# EAGLE design Arduino (EAGLE 6.5.0)
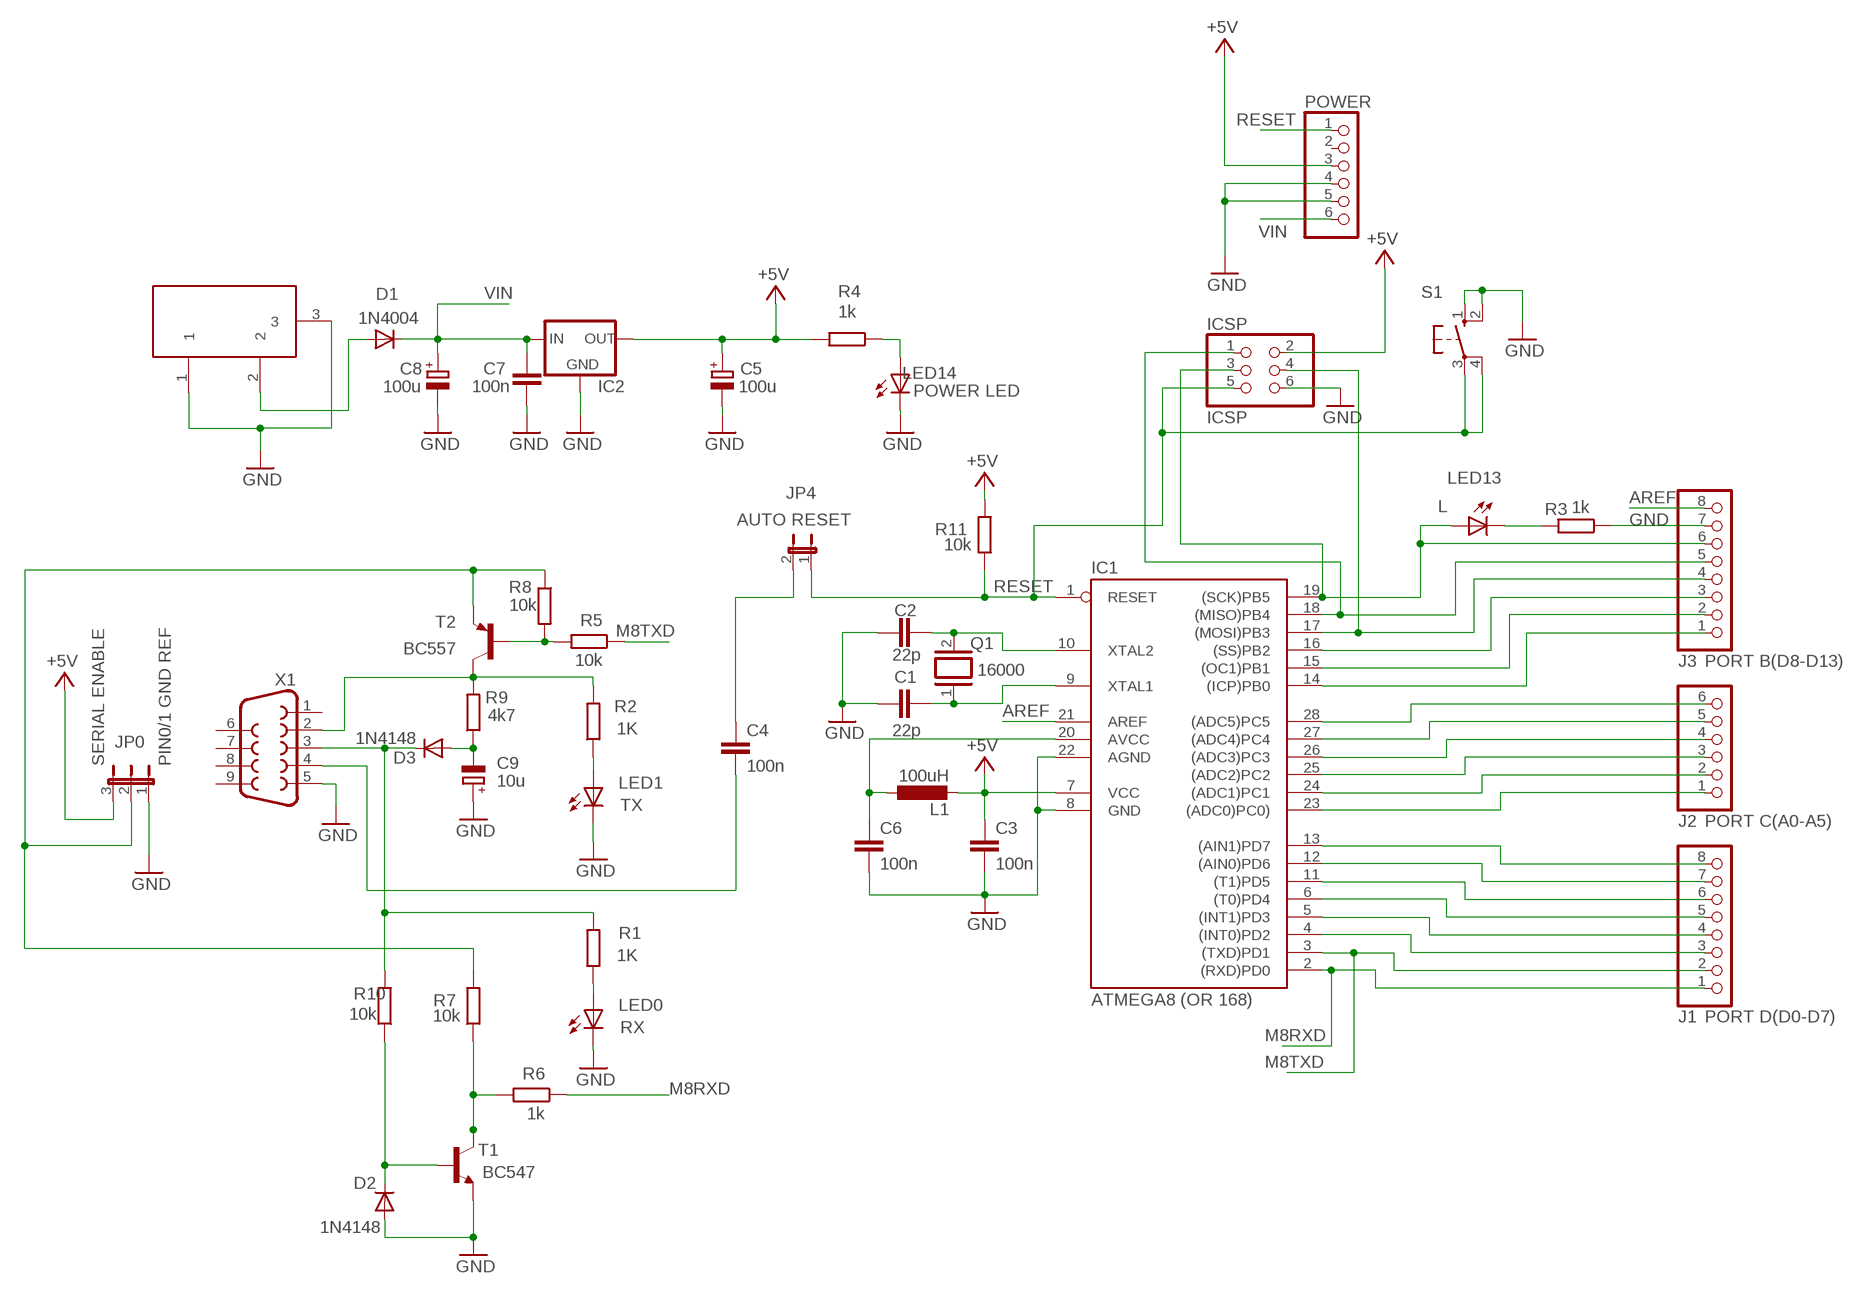
[diagram p0: schematic, sheet 1]

## Parts
C1  22p  C-EU050-025X075  [C050-025X075]
C2  22p  C-EU050-025X075  [C050-025X075]
C3  100n  C-EU050-025X075  [C050-025X075]
C4  100n  C-EU050-025X075  [C050-025X075]
C5  100u  CPOL-EUE3.5-8  [E3,5-8]
C6  100n  C-EU050-025X075  [C050-025X075]
C7  100n  C-EU050-025X075  [C050-025X075]
C8  100u  CPOL-EUE3.5-8  [E3,5-8]
C9  10u  CPOL-EUE5-6  [E5-6]
D1  1N4004  [DO41-10]
D2  1N4148  [DO35-10]
D3  1N4148  [DO35-10]
DC1  DC21MMX  [DC-21MM]
IC1  ATMEGA8 (OR 168)  AT90S4433P  [DIL28-3]
IC2  78XXL  [78XXL]
ICSP  ICSP  PINHD-2X3  [2X03]
J1  PORT D(D0-D7)  PINHD-1X8  [1X08]
J2  PORT C(A0-A5)  PINHD-1X6  [1X06]
J3  PORT B(D8-D13)  PINHD-1X8  [1X08]
JP0  JP2W  [JP2W]
JP4  AUTO RESET  JP1W  [JP1W]
L1  100uH  L-EU0207/10  [0207/10]
LED0  RX  LED3MM  [LED3MM]
LED1  TX  LED3MM  [LED3MM]
LED13  L  LED3MM  [LED3MM]
LED14  POWER LED  LED3MM  [LED3MM]
POWER  PINHD-1X6  [1X06]
Q1  16000  XTAL  [Q]
R1  1K  R-EU_0207/10  [0207/10]
R2  1K  R-EU_0207/10  [0207/10]
R3  1k  R-EU_0207/10  [0207/10]
R4  1k  R-EU_0207/10  [0207/10]
R5  10k  R-EU_0207/10  [0207/10]
R6  1k  R-EU_0207/10  [0207/10]
R7  10k  R-EU_0207/10  [0207/10]
R8  10k  R-EU_0207/10  [0207/10]
R9  4k7  R-EU_0207/10  [0207/10]
R10  10k  R-EU_0207/10  [0207/10]
R11  10k  R-EU_0207/10  [0207/10]
S1  10-XX  [B3F-10XX]
T1  BC547  [TO92]
T2  BC557  BC557B-PNP-TO92-EBC  [TO92-EBC]
X1  F09H  [F09H]

## Nets
+5V [power]: C3.1 C5.+ IC1.7(VCC) IC2.OUT ICSP.2 JP0.3 L1.2 POWER.3 R4.2 R11.2
AREF: IC1.21(AREF) J3.8
GND: C1.1 C2.1 C3.2 C5.- C6.2 C7.1 C8.- C9.+ D2.A DC1.1 DC1.3 IC1.8(GND) IC1.22(AGND) IC2.GND ICSP.6 J3.7 JP0.1 LED0.K(C) LED1.K(C) LED14.K(C) POWER.4 POWER.5 R3.1 S1.1(S) S1.2(S1) T1.1(E) X1.5
M8RXD: IC1.2((RXD)PD0) J1.1 R6.1
M8TXD: IC1.3((TXD)PD1) J1.2 R5.1
N$1: IC1.18((MISO)PB4) ICSP.1 J3.5
N$2: C9.- D3.A R9.1
N$3: LED14.A R4.1
N$4: IC1.17((MOSI)PB3) ICSP.4 J3.4
N$5: IC1.14((ICP)PB0) J3.1
N$6: C1.2 IC1.9(XTAL1) Q1.1
N$7: C2.2 IC1.10(XTAL2) Q1.2
N$8: D1.A DC1.2
N$10: IC1.4((INT0)PD2) J1.3
N$11: IC1.5((INT1)PD3) J1.4
N$12: IC1.6((T0)PD4) J1.5
N$13: IC1.11((T1)PD5) J1.6
N$14: IC1.12((AIN0)PD6) J1.7
N$15: IC1.13((AIN1)PD7) J1.8
N$16: IC1.23((ADC0)PC0)) J2.1
N$17: IC1.24((ADC1)PC1) J2.2
N$18: IC1.25((ADC2)PC2) J2.3
N$19: IC1.26((ADC3)PC3) J2.4
N$20: IC1.27((ADC4)PC4) J2.5
N$21: IC1.28((ADC5)PC5) J2.6
N$22: IC1.15((OC1)PB1) J3.2
N$23: IC1.16((SS)PB2) J3.3
N$25: D3.C R1.2 R10.2 X1.3
N$26: R6.2 R7.1 T1.3(C)
N$27: R5.2 R8.2 T2.B
N$29: D2.C R10.1 T1.2(B)
N$31: LED13.K(C) R3.2
N$32: LED1.A R2.1
N$33: LED0.A R1.1
N$34: C4.1 JP4.2
N$38: C4.2 X1.4
N$39: R2.2 R9.2 T2.C X1.2
N$42 [power]: C6.1 IC1.20(AVCC) L1.1
RESET: IC1.1(RESET) ICSP.5 JP4.1 POWER.1 R11.1 S1.3(P) S1.4(P1)
SCK: IC1.19((SCK)PB5) ICSP.3 J3.6 LED13.A
SERIAL_VCC: JP0.2 R7.2 R8.1 T2.E
VIN [power]: C7.2 C8.+ D1.C IC2.IN POWER.6
Unconnected: POWER.2 X1.1 X1.6 X1.7 X1.8 X1.9

## Notes on the sheet
- SERIAL ENABLE | PIN0/1 GND REF

## Library data of the parts
C1-C4 C6 C7 = rcl:C-EU: CAPACITOR, European symbol
C5 C8 C9 = rcl:CPOL-EU: POLARIZED CAPACITOR, European symbol
D1 = diode:1N4004: DIODE general purpose rectifier, 1 A
D2 D3 = diode:1N4148: DIODE high speed (Philips)
DC1 = powersupply:DC21MM
IC1 = atmel:AT90S4433: MICROCONTROLLER 4 Kbytes FLASH 128 bytes SRAM 256 bytes EEPROM UART 6-channel 10 bit ADC
IC2 = v-reg:78XXL: VOLTAGE REGULATOR
ICSP = pinhead:PINHD-2X3: PIN HEADER
J1 J3 = pinhead:PINHD-1X8: PIN HEADER
J2 POWER = pinhead:PINHD-1X6: PIN HEADER
JP0 = jumper:JP2W: JUMPER
JP4 = jumper:JP1W
L1 = rcl:L-EU: INDUCTOR, European symbol
LED0 LED1 LED13 LED14 = led:LED: LED OSRAM: - CHIPLED LG R971, LG N971, LY N971, LG Q971, LY Q971, LO R971, LY R971 LH N974, LH R974 LS Q976, LO Q976, LY Q976 LO Q996 - Hyper CHIPLED LW Q18S LB Q993, LB Q99A, LB R99A - SideLED LS A670, LO A670, LY A670, LG A670, LP A670 LB A673, LV A673, LT A673, LW A673 LH A674 LY A675 LS A676, LA A676, LO A676, LY A676, LW A676 LS A679, LY A679, LG A679 - Hyper Micro SIDELED® LS Y876, LA Y876, LO Y876, LY Y876 LT Y87S - SmartLED LW L88C, LW L88S LB L89C, LB L89S, LG L890 LS L89K, LO L89K, LY L89K LS L896, LA L896, LO L896, LY L896 - TOPLED LS T670, LO T670, LY T670, LG T670, LP T670 LSG T670, LSP T670, LSY T670, LOP T670, LYG T670 LG T671, LOG T671, LSG T671 LB T673, LV T673, LT T673, LW T673 LH T674 LS T676, LA T676, LO T676, LY T676, LB T676, LH T676, LSB T676, LW T676 LB T67C, LV T67C, LT T67C, LS T67K, LO T67K, LY T67K, LW E67C LS E67B, LA E67B, LO E67B, LY E67B, LB E67C, LV E67C, LT E67C LW T67C LS T679, LY T679, LG T679 LS T770, LO T770, LY T770, LG T770, LP T770 LB T773, LV T773, LT T773, LW T773 LH T774 LS E675, LA E675, LY E675, LS T675 LS T776, LA T776, LO T776, LY T776, LB T776 LHGB T686 LT T68C, LB T68C - Hyper Mini TOPLED® LB M676 - Mini TOPLED Santana® LG M470 LS M47K, LO M47K, LY M47K Source: http://www.osram.convergy.de/
Q1 = special:XTAL: CRYSTAL
R1-R11 = rcl:R-EU_: RESISTOR, European symbol
S1 = switch-omron:10-XX: OMRON SWITCH
T1 = transistor:BC547: NPN TRANSISTOR
T2 = transistor:*-PNP-: PNP Transistror
X1 = con-subd:F09: SUB-D

## Net classes
1 power: width 0.61 mm

## Board
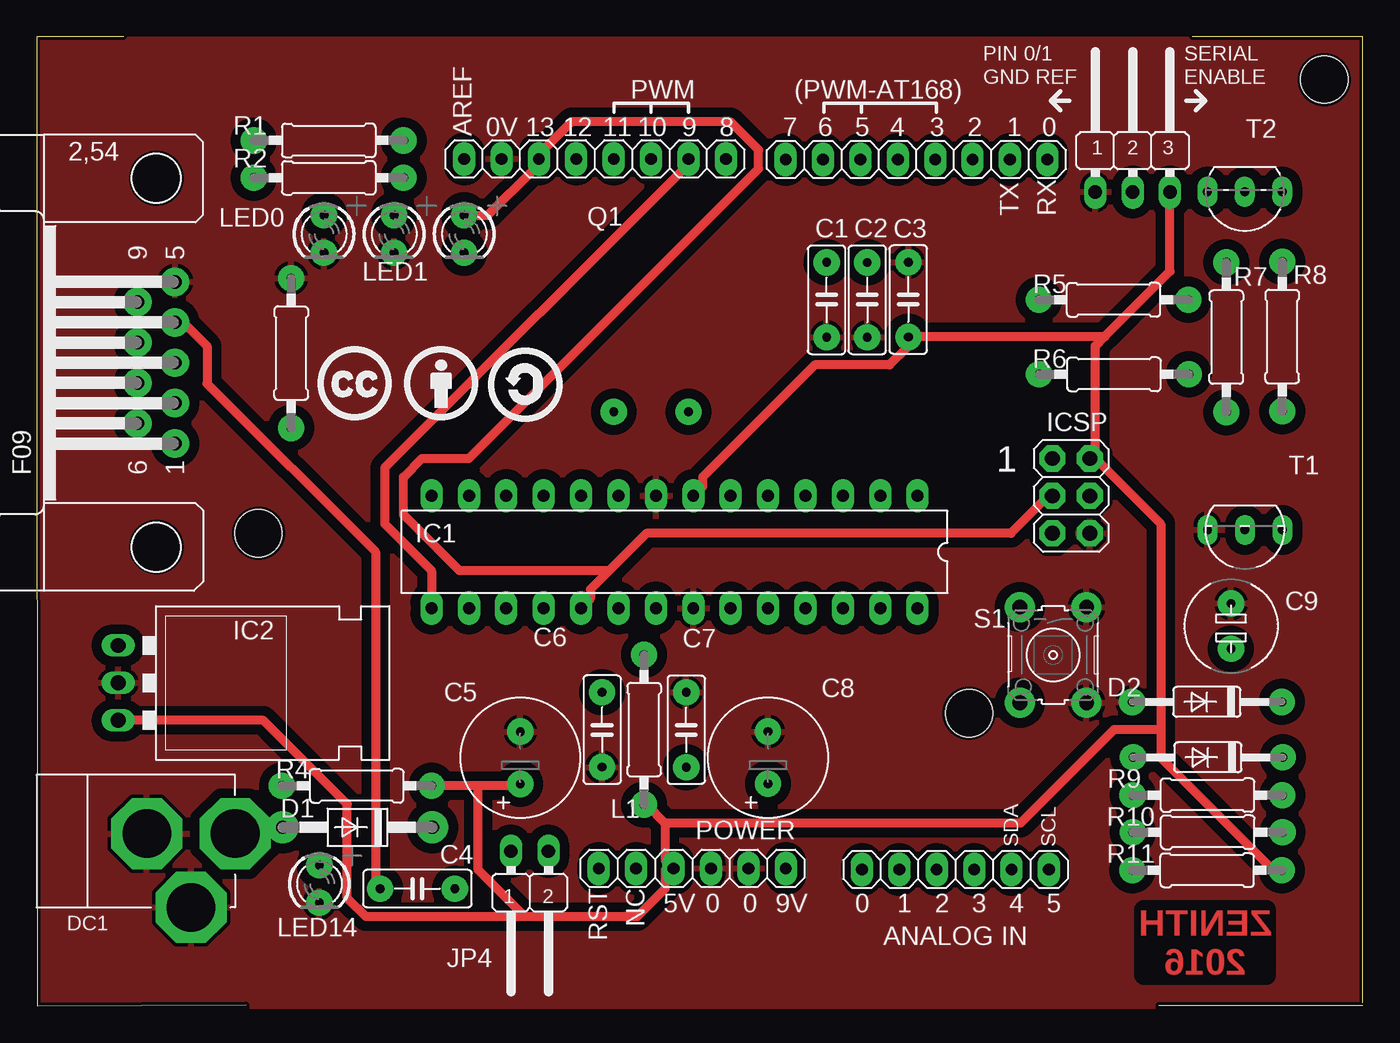
[diagram p1: board, top side]
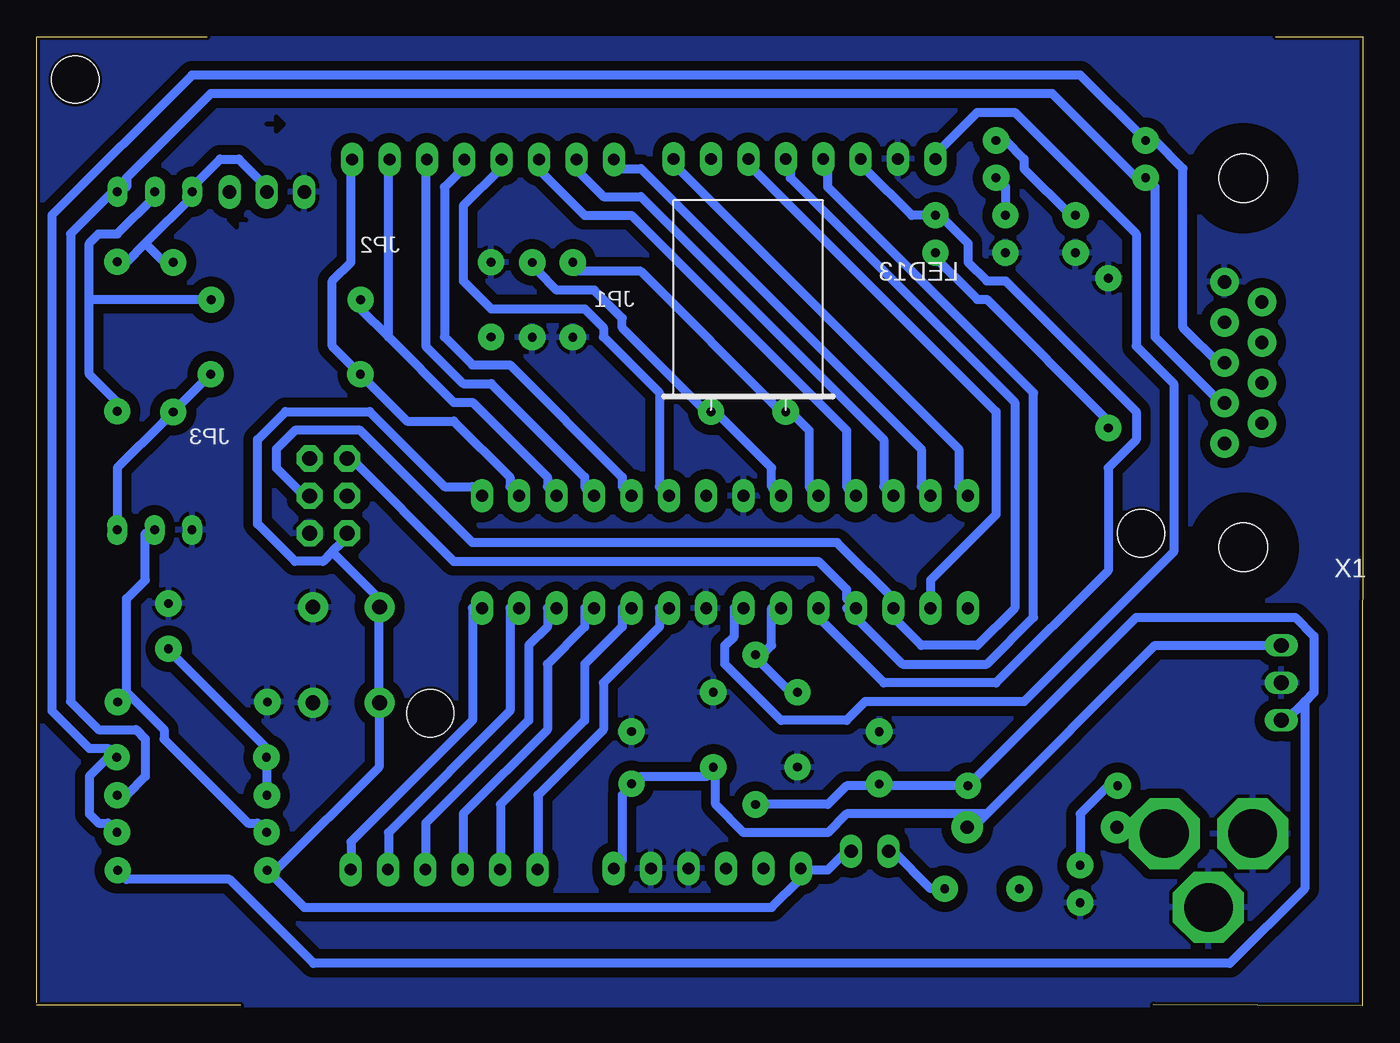
[diagram p2: board, bottom side, seen from below]

Size 90.06 x 65.8 mm. Coordinates in mm from the lower left corner, seen from the top.
Outline: 0.01,65.8 0.01,55.13 0.02,0 14.23,0.06
Outline: 76.2,0.06 90.06,0.06
Outline: 90.05,65.78 78.5,65.78
Outline: 5.91,65.79 0,65.79
Outline: 90.06,0.21 90.06,54.39
Outline: 90.05,54.23 90.05,65.78
Copper layers (1*16): Top 0.035mm / dielectric 1.5mm / Bottom 0.035mm
Design rules "gizmo *": minimum track width 0.6mm, minimum drill 40mil, track to track 0.67mm, track to pad 0.67mm, pad to pad 0.67mm, via to via 0.67mm, smd to smd 0mil, copper to edge 8mil, drill to drill 8mil, minimum pad ring 10mil, minimum via ring 8mil, stop-mask expansion 0mil, vias tented up to drill 0mil, thermal gap 10mil
Holes 3.2 mm at 87.45,62.89 63.32,19.86 15.06,32.09
bRestrict: 6 lines

### Footprints (pad centres in the part's own frame; a part is rotated, then mirrored left to right if it is on the bottom)
C050-025X075 = drill 0.6 pad 1.778: 1 -2.54,0; 2 2.54,0
E3,5-8 = drill 0.6 pad 1.778: + -1.778,0; - 1.778,0
E5-6 = drill 0.6 pad 1.778: + -1.54,0; - 1.54,0
DO41-10 = drill 0.9 pad 2.159: A 5.08,0; C -5.08,0
DO35-10 = drill 0.6 pad 1.778: A 5.08,0; C -5.08,0
DC-21MM = drill 3.302 pad 4.826 octagon: 1 -5.08,-3.353; 2 -0.076,-6.35; 3 -0.076,-0.356
DIL28-3 = drill 0.813 pad 1.524 long: 1 -16.51,-3.81; 2 -13.97,-3.81; 3 -11.43,-3.81; 4 -8.89,-3.81; 5 -6.35,-3.81; 6 -3.81,-3.81; 7 -1.27,-3.81; 8 1.27,-3.81; 9 3.81,-3.81; 10 6.35,-3.81; 11 8.89,-3.81; 12 11.43,-3.81; 13 13.97,-3.81; 14 16.51,-3.81; 15 16.51,3.81; 16 13.97,3.81; 17 11.43,3.81; 18 8.89,3.81; 19 6.35,3.81; 20 3.81,3.81; 21 1.27,3.81; 22 -1.27,3.81; 23 -3.81,3.81; 24 -6.35,3.81; 25 -8.89,3.81; 26 -11.43,3.81; 27 -13.97,3.81; 28 -16.51,3.81
78XXL = drill 1.016 long: GND 0,-3.81; IN -2.54,-3.81; OUT 2.54,-3.81
2X03 = drill 1 pad 1.778 octagon: 1 -2.54,-1.27; 2 -2.54,1.27; 3 0,-1.27; 4 0,1.27; 5 2.54,-1.27; 6 2.54,1.27
1X08 = drill 0.8 pad 1.524 long: 1 -8.89,0; 2 -6.35,0; 3 -3.81,0; 4 -1.27,0; 5 1.27,0; 6 3.81,0; 7 6.35,0; 8 8.89,0
1X06 = drill 0.8 pad 1.524 long: 1 -6.35,0; 2 -3.81,0; 3 -1.27,0; 4 1.27,0; 5 3.81,0; 6 6.35,0
JP2W = drill 0.914 pad 1.524 long: 1 -2.54,-1.27; 2 0,-1.27; 3 2.54,-1.27
JP1W = drill 0.914 pad 1.524 long: 1 -1.27,-1.905; 2 1.27,-1.905
0207/10 = drill 0.6 pad 1.778: 1 -5.08,0; 2 5.08,0
LED3MM = drill 0.6 pad 1.778: A -1.27,0; K 1.27,0
Q = drill 0.6 pad 1.778: 1 -2.54,-7.62; 2 2.54,-7.62
B3F-10XX = drill 1 pad 2.032: 1 -3.251,2.261; 2 3.251,2.261; 3 -3.251,-2.261; 4 3.251,-2.261
TO92 = drill 0.6 pad 1.372 long: 1 2.54,0; 2 0,0; 3 -2.54,0
TO92-EBC = drill 0.6 pad 1.372 long: B 0,-1.27; C -2.54,-1.27; E 2.54,-1.27
F09H = drill 0.9 pad 1.93: 1 -5.486,-1.27; 2 -2.743,-1.27; 3 0,-1.27; 4 2.743,-1.27; 5 5.486,-1.27; 6 -4.115,1.27; 7 -1.372,1.27; 8 1.372,1.27; 9 4.115,1.27 | hole 3.302: -12.522,0; 12.522,0

### Placement (x,y rotation side)
C1  56.41,47.94 90 top
C2  53.65,47.94 90 top
C3  59.2,47.96 90 top
C4  25.86,7.96 180 top
C5  32.84,16.84 90 top
C6  38.4,18.75 270 top
C7  44.11,18.75 270 top
C8  49.67,16.85 90 top
C9  81.11,25.78 270 top
D1  21.79,12.12 180 top
D2  79.48,20.64 180 top
D3  79.54,16.87 180 top
DC1  7.12,11.77 90 top
IC1  43.32,30.82 180 top
IC2  9.35,21.93 270 top
ICSP  70.25,34.63 270 top
J1  59.75,57.47 180 top
J2  62.4,9.26 0 top
J3  37.91,57.51 180 top
JP0  74.43,56.54 0 top
JP4  33.48,8.59 180 top
L1  41.25,18.75 270 top
LED0  19.51,52.41 270 top
LED1  24.27,52.41 270 top
LED13  29.03,52.41 270 top
LED14  19.19,8.28 270 top
POWER  44.52,9.33 0 top
Q1  41.73,47.96 0 bottom
R1  19.82,58.76 180 top
R2  19.82,56.22 180 top
R3  17.28,44.32 270 top
R4  21.73,14.95 0 top
R5  73.14,47.94 0 top
R6  73.16,42.88 0 top
R7  80.79,45.4 90 top
R8  84.59,45.44 270 top
R9  79.51,14.31 0 top
R10  79.53,11.79 0 top
R11  79.49,9.21 0 top
S1  69.04,23.83 270 top
T1  82.06,32.32 180 top
T2  82.05,54 180 top
U$1  [CC]  19.03,39.71 0 top
U$2  [BY]  24.9,39.71 0 top
U$3  [SA]  30.62,39.71 0 top
X1  8.12,43.67 90 top

### Tracks (layer width: path | path; a pad name or v marks a point on that pad's centre or on a via)
+5V
  Top 0.61: 29.98,14.94 32.52,14.94 C5.+ | 29.98,14.94 27.44,14.94 R4.2 | 42.68,12.4 42.68,9.86 POWER.3 42.68,9.23 42.68,7.96 40.78,6.05 33.16,6.05 | 42.68,12.4 41.41,13.67 L1.2 | IC2.OUT 15.38,19.39 21.09,13.67 21.09,7.32 22.36,6.05 33.16,6.05 | 29.98,14.94 29.98,9.23 33.16,6.05 | IC1.7 45.22,35.26 45.22,35.9 52.84,43.52 57.92,43.52 59.19,44.79 C3.1 59.83,45.42 72.53,45.42 | JP0.3 76.97,49.87 72.53,45.42 | 72.53,45.42 71.89,44.79 71.89,37.17 | 76.34,18.75 76.34,32.72 71.89,37.17 | 76.34,18.75 76.34,16.85 83.96,9.23 R11.2 | 71.89,37.17 ICSP.2 | 42.68,12.4 66.81,12.4 73.16,18.75 76.34,18.75
  Bottom 0.61: 3.95,20.66 3.31,21.29 3.31,25.1 4.58,26.37 15.38,26.37 R4.2 27.44,14.94 32.52,14.94 C5.+ 33.16,14.94 35.06,14.94 36.33,13.67 L1.2 | 3.95,20.66 5.22,19.39 IC2.OUT | 3.95,20.66 3.95,7.96 9.03,2.88 71.26,2.88 76.97,8.59 83.96,8.59 R11.2
AREF
  Bottom 0.6: IC1.21 42.68,27.01 42.68,25.1 43.32,24.47 43.32,23.2 39.51,19.39 35.06,19.39 33.79,20.66 23,20.66 12.84,30.82 12.84,42.25 15.38,44.79 15.38,52.41 23.63,60.66 26.17,60.66 28.71,58.12 J3.8
GND
  Top 0.6: S1.2 71.26,20.66 S1.2 | 71.26,27.01 S1.1
  pour Bottom: 0.12,65.63 90.14,65.63 90.14,0.1 0.12,0.1
  pour Top: 0.12,65.63 90.02,65.63 90.02,-0.01 0.12,-0.01
M8RXD
  Bottom 0.6: IC1.2 57.92,35.26 57.92,35.9 61.73,39.71 64.91,39.71 R6.1 69.99,44.79 69.99,49.23 68.72,50.5 68.72,56.85 J1.1
M8TXD
  Bottom 0.6: 66.18,45.42 68.08,47.33 R5.1 | 66.18,45.42 61.73,40.98 60.46,40.98 55.38,35.9 55.38,35.26 IC1.3 | 66.18,45.42 66.18,56.85 J1.2
N$1
  Bottom 0.6: ICSP.1 68.72,37.17 61.73,30.18 36.97,30.18 35.06,28.28 35.06,27.64 IC1.18 35.06,27.01 31.25,23.2 25.54,23.2 22.36,26.37 22.36,41.61 36.33,55.58 36.33,57.49 J3.5
N$2
  Bottom 0.6: R9.1 74.43,16.85 D3.A 74.43,17.48 80.78,23.83 C9.-
N$3
  Bottom 0.6: LED14.A 19.19,9.86 19.19,13.04 17.28,14.94 R4.1
N$4
  Bottom 0.6: J3.4 38.87,57.49 38.87,56.22 23.63,40.98 23.63,27.01 26.17,24.47 29.98,24.47 31.89,26.37 IC1.17 31.89,27.64 35.7,31.45 60.46,31.45 68.08,39.07 72.53,39.07 73.8,37.8 73.8,36.53 71.89,34.63 ICSP.4
N$5
  Bottom 0.6: IC1.14 27.44,35.26 27.44,37.8 47.13,57.49 J3.1
N$6
  Bottom 0.6: IC1.9 40.14,35.26 40.14,36.53 43.95,40.34 Q1.1 44.59,40.34 50.3,46.06 50.3,46.69 52.21,48.6 54.75,48.6 56.02,49.87 C1.2
N$7
  Bottom 0.6: IC1.10 37.6,35.26 37.6,39.07 38.87,40.34 Q1.2 39.51,40.34 49.03,49.87 53.48,49.87 C2.2
N$8
  Bottom 0.6: D1.A 16.65,11.77 13.47,11.77 DC1.2
N$10
  Bottom 0.6: IC1.4 52.84,35.26 52.84,35.9 59.19,42.25 61.1,42.25 63.64,44.79 63.64,56.85 J1.3
N$11
  Bottom 0.6: IC1.5 50.3,35.26 50.3,35.9 57.92,43.52 60.46,43.52 62.37,45.42 62.37,55.58 61.1,56.85 J1.4
N$12
  Bottom 0.6: IC1.6 47.76,35.26 47.76,41.61 51.57,45.42 51.57,46.06 52.84,47.33 59.19,47.33 61.1,49.23 61.1,54.31 58.56,56.85 J1.5
N$13
  Bottom 0.6: IC1.11 35.06,35.26 35.06,39.07 49.67,53.68 52.84,53.68 56.02,56.85 J1.6
N$14
  Bottom 0.6: IC1.12 32.52,35.26 32.52,38.44 49.03,54.95 51.57,54.95 53.48,56.85 J1.7
N$15
  Bottom 0.6: IC1.13 29.98,35.26 29.98,37.8 49.03,56.85 50.3,56.85 J1.8
N$16
  Bottom 0.6: J2.1 56.02,9.86 56.02,14.31 51.57,18.75 51.57,21.93 47.76,25.74 47.76,27.01 IC1.23
N$17
  Bottom 0.6: J2.2 58.56,9.86 58.56,13.67 52.84,19.39 52.84,23.2 50.3,25.74 50.3,27.01 IC1.24
N$18
  Bottom 0.6: J2.3 61.1,9.86 61.1,13.04 55.38,18.75 55.38,23.2 52.84,25.74 52.84,27.01 IC1.25
N$19
  Bottom 0.6: J2.4 63.64,9.86 63.64,12.4 56.65,19.39 56.65,24.47 55.38,25.74 55.38,27.01 IC1.26
N$20
  Bottom 0.6: J2.5 66.18,9.86 66.18,11.77 57.92,20.02 57.92,27.01 IC1.27
N$21
  Bottom 0.6: J2.6 68.72,9.86 68.72,11.13 60.46,19.39 60.46,27.01 IC1.28
N$22
  Top 0.6: IC1.15 26.81,27.64 26.81,29.55 23.63,32.72 23.63,36.53 44.59,57.49 J3.2
N$23
  Bottom 0.6: IC1.16 29.35,27.64 29.35,28.91 24.9,33.36 24.9,40.34 42.05,57.49 J3.3
N$25
  Bottom 0.6: R10.2 85.23,12.4 85.86,12.4 86.5,13.04 86.5,15.58 85.23,16.85 D3.C 85.23,17.48 86.5,17.48 89.04,20.02 89.04,53.68 79.51,63.2 19.19,63.2 R1.2 14.11,58.76 12.2,56.85 12.2,46.06 9.66,43.52 X1.3
N$26
  Bottom 0.6: T1.3 84.59,32.72 84.59,36.53 81.42,39.71 R7.1 80.78,40.34 R6.2
N$27
  Bottom 0.6: 86.5,47.96 86.5,42.88 84.59,40.98 R8.2 | 86.5,47.96 86.5,51.77 85.86,52.41 84.59,52.41 82.05,54.95 T2.B | 86.5,47.96 78.24,47.96 R5.2
N$29
  Bottom 0.6: 83.96,21.29 83.96,20.66 D2.C 83.96,21.29 | 83.96,21.29 83.96,27.64 82.69,28.91 82.69,32.09 T1.2 | 83.96,21.29 81.42,18.75 81.42,18.12 75.7,12.4 75.07,12.4 R10.1
N$31
  Bottom 0.6: R3.2 17.28,39.71 25.54,47.96 26.17,47.96 29.35,51.14 LED13.K
N$32
  Bottom 0.6: LED1.A 24.27,55.58 R2.1
N$33
  Bottom 0.6: R1.1 24.27,58.76 23,57.49 23,56.85 19.82,53.68 LED0.A
N$34
  Bottom 0.6: C4.1 29.35,7.96 31.89,10.5 JP4.2
N$38
  Top 0.6: C4.2 23,7.96 23,30.82 11.57,42.25 11.57,44.79 9.66,46.69 X1.4
N$39
  Bottom 0.6: R9.2 83.96,14.31 82.69,15.58 82.69,18.12 83.32,18.75 85.86,18.75 87.77,20.66 87.77,52.41 84.59,55.58 T2.C 83.96,55.58 83.96,56.22 78.24,61.93 21.09,61.93 15.38,56.22 R2.2 14.11,55.58 14.11,45.42 9.66,40.98 X1.2
N$42
  Bottom 0.61: IC1.20 40.14,27.01 40.14,24.47 40.78,23.83 L1.1 41.41,23.83 38.87,21.29 C6.1
RESET
  Top 0.6: 66.81,27.01 S1.3 | S1.4 66.81,20.66
  Bottom 0.6: 69.99,30.82 69.35,31.45 ICSP.5 | 69.99,30.82 70.62,30.18 72.53,30.18 75.07,32.72 75.07,38.44 73.16,40.34 67.45,40.34 62.37,35.26 60.46,35.26 IC1.1 | 69.99,30.82 66.81,27.64 S1.3 66.81,27.01 66.81,20.66 S1.4 66.81,20.02 66.81,16.21 73.8,9.23 R11.1 73.8,8.59 71.89,6.69 40.14,6.69 38.24,8.59 38.24,9.23 POWER.1 37.6,9.23 36.33,9.23 35.06,10.5 JP4.1
SCK
  Top 0.6: LED13.A 30.62,53.68 33.79,56.85 33.79,57.49 J3.6 34.43,58.12 36.33,60.03 47.13,60.03 49.03,58.12 49.03,56.85 29.35,37.17 26.17,37.17 24.9,35.9 24.9,33.36 28.71,29.55 38.87,29.55 | 38.87,29.55 41.41,32.09 66.18,32.09 68.72,34.63 ICSP.3 | 38.87,29.55 37.6,28.28 37.6,27.64 IC1.19
  Bottom 0.6: J3.6 33.79,57.49 33.79,56.85 30.62,53.68 LED13.A 28.71,53.68 26.81,51.77 26.81,50.5 25.54,49.23 24.27,49.23 15.38,40.34 15.38,38.44 17.28,36.53 17.28,29.55 24.9,21.93 32.52,21.93 36.97,26.37 IC1.19
SERIAL_VCC
  Bottom 0.6: 80.82,50.5 R7.2 81.42,50.5 82.69,51.77 | 82.69,51.77 83.96,50.5 R8.1 | 82.69,51.77 79.51,54.95 T2.E 79.51,55.58 77.61,57.49 76.34,57.49 74.43,55.58 JP0.2
VIN
  Bottom 0.61: POWER.6 50.3,9.86 50.3,14.31 49.67,14.94 C8.+ 49.03,15.58 44.59,15.58 C7.2 43.95,15.58 43.95,13.67 42.05,11.77 36.33,11.77 35.06,13.04 25.54,13.04 | IC2.IN 14.11,24.47 25.54,13.04 | 25.54,13.04 26.81,11.77 D1.C

### Text on the board
Top: ZENITH / 2016
tNames: PIN 0/1 | SERIAL | GND REF | ENABLE | PWM | (PWM-AT168) | AREF | 0V | 13 | 12 | 11 | 10 | 9 | 8 | 7 | 6 | 5 | 4 | 3 | 2 | 1 | 0 | TX | RX | 1 | SDA | SCL | 5V | 0 | 0 | 9V | 0 | 1 | 2 | 3 | 4 | 5 | NC | RST | ANALOG IN
bNames: JP2 | LED13 | JP1 | JP3
bValues: ENABLE
Cooper Text: A | 0V | 13 | 12 | 11 | 10 | 9 | 8 | 7 | 6 | 5 | 4 | 3 | 2 | 1 | 0 | 1 | RST | 5V | 0V | 0V | 9V | 0 | 1 | 2 | 3 | 4 | 5 | Analog in